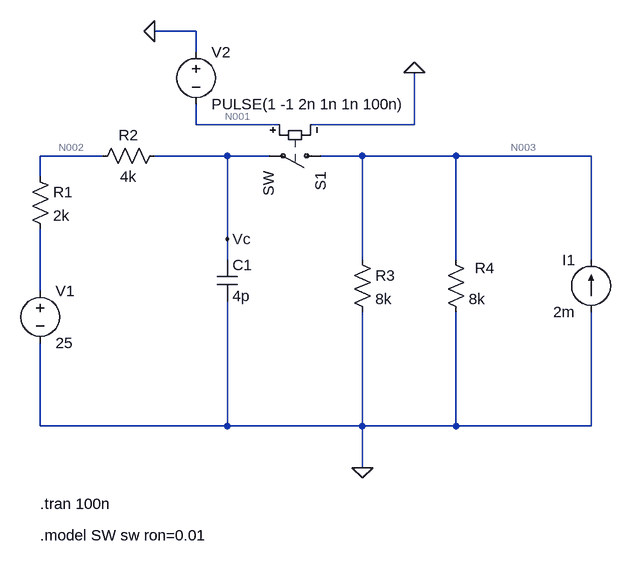
[diagram p0: schematic Circuit.asc]
Circuit.asc, the LTspice schematic file:
Version 4
SHEET 1 900 680
WIRE 256 -208 192 -208
WIRE 256 -176 256 -208
WIRE 256 -64 256 -96
WIRE 384 -64 256 -64
WIRE 592 -64 592 -144
WIRE 592 -64 432 -64
WIRE 112 -16 16 -16
WIRE 304 -16 192 -16
WIRE 368 -16 304 -16
WIRE 512 -16 448 -16
WIRE 656 -16 512 -16
WIRE 864 -16 656 -16
WIRE 16 16 16 -16
WIRE 304 112 304 -16
WIRE 304 144 304 112
WIRE 512 144 512 -16
WIRE 656 144 656 -16
WIRE 864 144 864 -16
WIRE 16 192 16 96
WIRE 16 400 16 272
WIRE 304 400 304 208
WIRE 304 400 16 400
WIRE 512 400 512 224
WIRE 512 400 304 400
WIRE 656 400 656 224
WIRE 656 400 512 400
WIRE 864 400 864 224
WIRE 864 400 656 400
WIRE 512 464 512 400
FLAG 512 464 0
FLAG 192 -208 0
FLAG 592 -144 0
FLAG 304 112 Vc
SYMBOL voltage 16 176 R0
SYMATTR InstName V1
SYMATTR Value 25
SYMBOL voltage 256 -192 R0
WINDOW 123 0 0 Left 0
WINDOW 39 0 0 Left 0
SYMATTR InstName V2
SYMATTR Value PULSE(1 -1 2n 1n 1n 100n)
SYMBOL cap 288 144 R0
SYMATTR InstName C1
SYMATTR Value 4p
SYMBOL res 0 0 R0
SYMATTR InstName R1
SYMATTR Value 2k
SYMBOL res 208 -32 R90
WINDOW 0 0 56 VBottom 2
WINDOW 3 32 56 VTop 2
SYMATTR InstName R2
SYMATTR Value 4k
SYMBOL res 496 128 R0
SYMATTR InstName R3
SYMATTR Value 8k
SYMBOL res 640 128 R0
WINDOW 0 45 29 Left 2
SYMATTR InstName R4
SYMATTR Value 8k
SYMBOL sw 464 -16 R90
SYMATTR InstName S1
SYMBOL current 864 224 R180
WINDOW 0 24 80 Left 2
WINDOW 3 24 0 Left 2
WINDOW 123 0 0 Left 0
WINDOW 39 0 0 Left 0
SYMATTR InstName I1
SYMATTR Value 2m
TEXT 16 568 Left 2 !.model SW sw ron=0.01
TEXT 16 520 Left 2 !.tran 100n

The netlist it stands for:
* Circuit.asc
V1 N004 0 25
V2 0 N001 PULSE(1 -1 2n 1n 1n 100n)
C1 Vc 0 4p
R1 N002 N004 2k
R2 Vc N002 4k
R3 N003 0 8k
R4 N003 0 8k
S1 N003 Vc N001 0 SW
I1 0 N003 2m
.model SW sw ron=0.01
.tran 100n
.backanno
.end

* Results of the author's LTspice run, read from the files saved beside the schematic
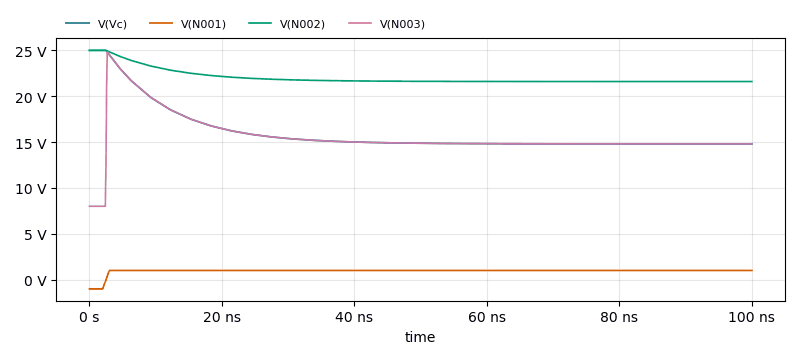
[diagram p1: Transient Analysis of Circuit.asc, plotted from the saved traces]
* Transient Analysis, 1 run:
*   V(Vc): min 14.8 V, max 25 V, average 16.04 V, rms 16.24 V, last 14.8 V
*   V(N001): min -1 V, max 1 V, average 950 mV, rms 996.9 mV, last 1 V
*   V(N002): min 21.6 V, max 25 V, average 22.01 V, rms 22.03 V, last 21.6 V
*   V(N003): min 8 V, max 24.85 V, average 15.61 V, rms 15.79 V, last 14.8 V